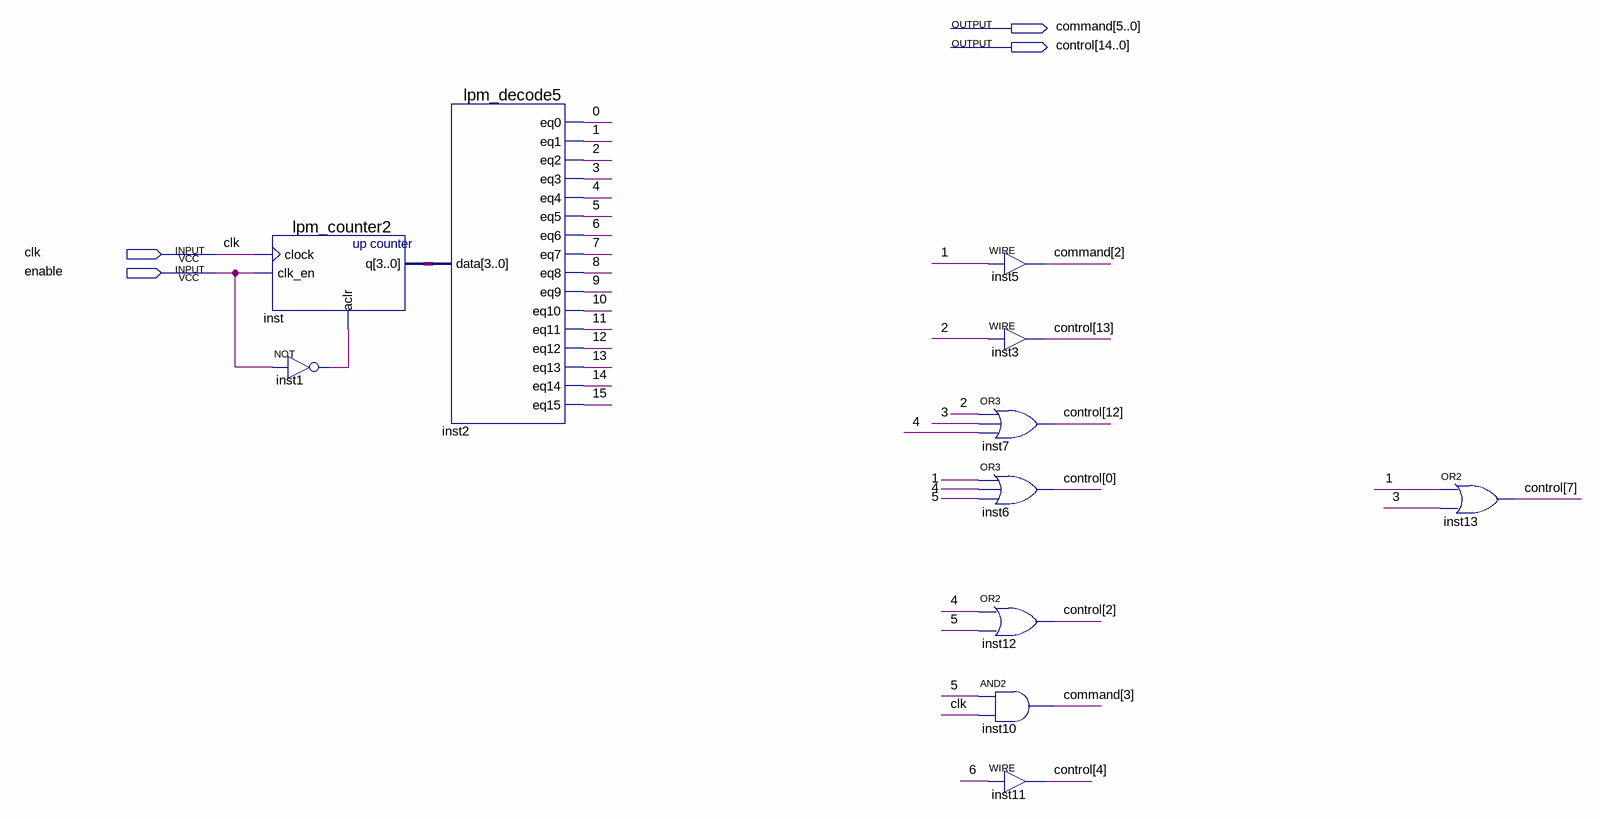
[diagram p0: schematic sheet]
// Quartus schematic not1.bdf as structural Verilog: 11 symbols, 4 pins
module not1 (
  input  clk,
  input  enable,
  output [5:0] command,
  output [14:0] control
);

  wire \0 , \1 , \2 , \3 , \4 , \5 , \6 , \7 , \8 , \9 , \10 , \11 , \12 , \13 , \14 , \15 , inst1_out;
  wire [3:0] inst_q;

  lpm_counter2 inst (.clock(clk), .clk_en(enable), .aclr(inst1_out), .q(inst_q));
  not inst1 (inst1_out, enable);
  lpm_decode5 inst2 (
    .data(inst_q), .eq0(\0 ), .eq1(\1 ), .eq2(\2 ), .eq3(\3 ), .eq4(\4 ), .eq5(\5 ), .eq6(\6 ), .eq7(\7 ),
    .eq8(\8 ), .eq9(\9 ), .eq10(\10 ), .eq11(\11 ), .eq12(\12 ), .eq13(\13 ), .eq14(\14 ), .eq15(\15 ));
  assign command[2] = \1 ;  // WIRE inst5
  assign control[13] = \2 ;  // WIRE inst3
  or inst7 (control[12], \2 , \3 , \4 );
  or inst6 (control[0], \1 , \4 , \5 );
  or inst12 (control[2], \4 , \5 );
  and inst10 (command[3], \5 , clk);
  assign control[4] = \6 ;  // WIRE inst11
  or inst13 (control[7], \1 , \3 );
endmodule
